# Altium schematic sheet Motor.SchDoc
size A
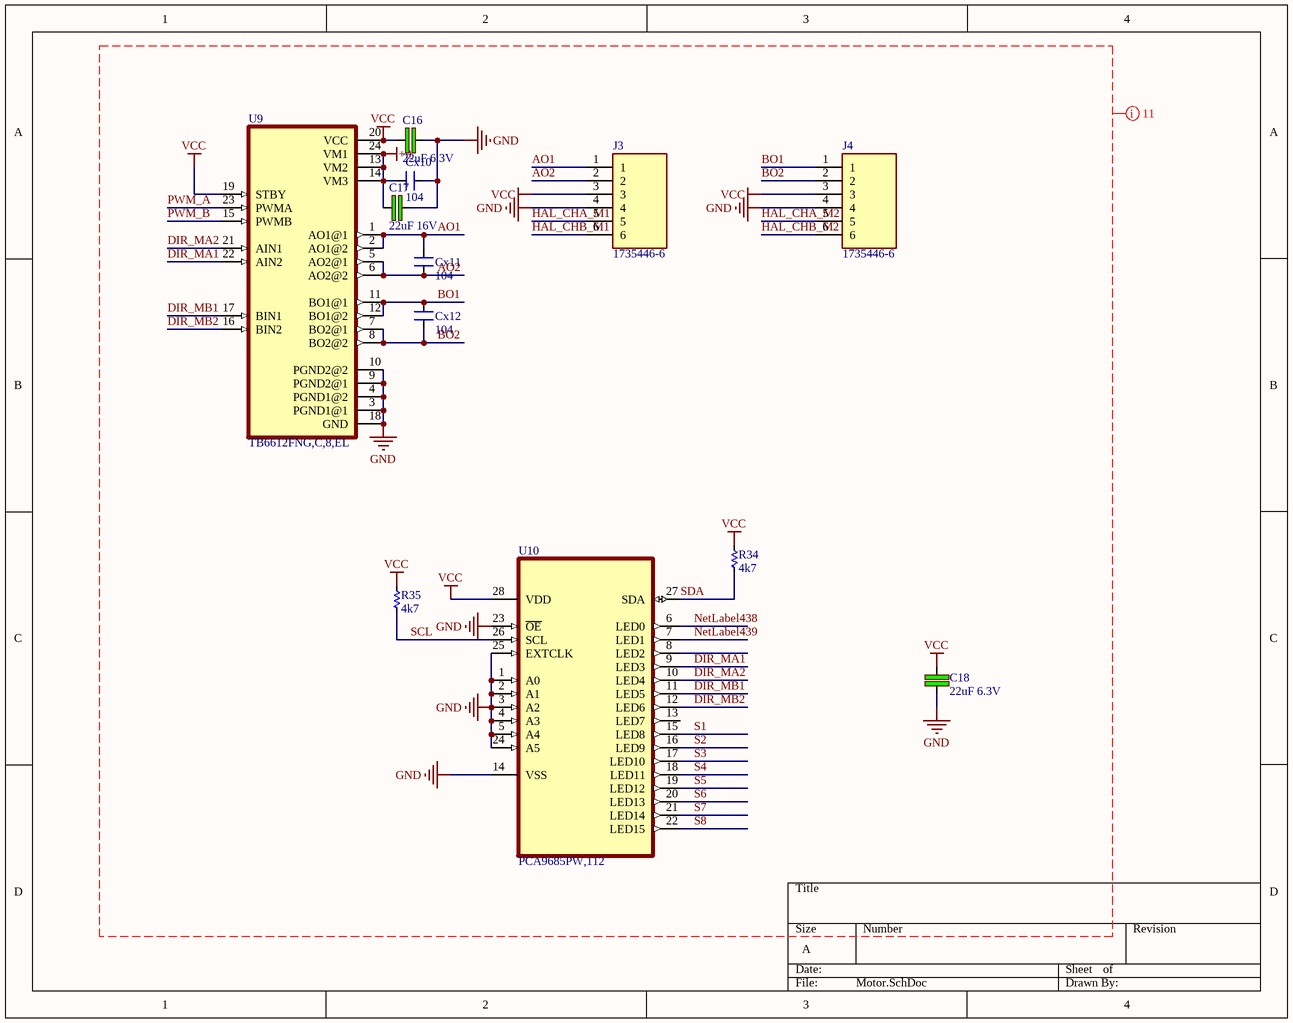
[diagram p0: Motor.SchDoc]

## Parts
C16  22uF 6.3V  [CN-SMD-1206]
C17  22uF 16V  [CN-SMD-1206]
C18  22uF 6.3V  [CN-SMD-1206]
Cx10  104  [CN-SMD-0603]
Cx11  104  [CN-SMD-0603]
Cx12  104  [CN-SMD-0603]
J3  1735446-6  [TE_1735446-6]
J4  1735446-6  [TE_1735446-6]
R34  4k7  [RES-SMD-0603]
R35  4k7  [RES-SMD-0603]
U9  TB6612FNG,C,8,EL  [SOP65P760X160-24N]
U10  PCA9685PW,112  [SOP65P640X110-28N]

## Nets
+9: C17.1 Cx10.2 U9.13(VM2) U9.14(VM3) U9.24(VM1)
GND: C16.1 C17.2 C18.1 Cx10.1 J3.4 J4.4 U9.3(PGND1@1) U9.4(PGND1@2) U9.9(PGND2@1) U9.10(PGND2@2) U9.18(GND) U10.1(A0) U10.2(A1) U10.3(A2) U10.4(A3) U10.5(A4) U10.14(VSS) U10.23(~{OE}) U10.24(A5) U10.25(EXTCLK)
VCC: C16.2 C18.2 J3.3 J4.3 R34.2 R35.2 U9.19(STBY) U9.20(VCC) U10.28(VDD)
AO1: Cx11.1 J3.1 U9.1(AO1@1) U9.2(AO1@2)
AO2: Cx11.2 J3.2 U9.5(AO2@1) U9.6(AO2@2)
BO1: Cx12.1 J4.1 U9.11(BO1@1) U9.12(BO1@2)
BO2: Cx12.2 J4.2 U9.7(BO2@1) U9.8(BO2@2)
DIR_MA1: U9.22(AIN2) U10.9(LED3)
DIR_MA2: U9.21(AIN1) U10.10(LED4)
DIR_MB1: U9.17(BIN1) U10.11(LED5)
DIR_MB2: U9.16(BIN2) U10.12(LED6)
HAL_CHA_M1: J3.5
HAL_CHA_M2: J4.5
HAL_CHB_M1: J3.6
HAL_CHB_M2: J4.6
NetLabel438: U10.6(LED0)
NetLabel439: U10.7(LED1)
PWM_A: U9.23(PWMA)
PWM_B: U9.15(PWMB)
S1: U10.15(LED8)
S2: U10.16(LED9)
S3: U10.17(LED10)
S4: U10.18(LED11)
S5: U10.19(LED12)
S6: U10.20(LED13)
S7: U10.21(LED14)
S8: U10.22(LED15)
SCL: R35.1 U10.26(SCL)
SDA: R34.1 U10.27(SDA)

Not connected (* = marked no-connect by the designer): U10 8(LED2) 13(LED7)

## Layout directives
net class Motor: +9, AO1, AO2, BO1, BO2, DIR_MA1, DIR_MA2, DIR_MB1, DIR_MB2, GND, HAL_CHA_M1, HAL_CHA_M2, HAL_CHB_M1, HAL_CHB_M2, NetLabel438, NetLabel439, PWM_A, PWM_B, S1, S2, S3, S4, S5, S6, S7, S8, SCL, SDA, VCC

## Library data of the parts
C16-C18 = C: Cap SMD 1206 >5V; Value: 103
Cx10-Cx12 = CN: Value: 33pF
J3 J4 = 1735446-6: 2MM PITCH HPI POST HEADER, VERTICAL, 6P; Centerline_Pitch: 2 mm[.079 in]; Number_of_Positions: 6; MF: TE Connectivity; Product_Type: Connector; Availability: Unavailable; EU_RoHS_Compliance: Compliant; SnapEDA_Link: https://www.snapeda.com/parts/1735446-6/TE%20Connectivity%20AMP%20Connectors/view-part/492311/?ref=snap; Price: None; Package: None; MP: 1735446-6; TE_purchase_URL: https://www.te.com/usa-en/product-1735446-6.html?te_bu=Cor&te_type=disp&te_campaign=seda_glo_cor-seda-global-disp-prtnr-fy19-seda-model-bom-cta_sma-317_1&elqCampaignId=32493; Value: *
R34 R35 = Res-SMD: Resistor; Manufacturer: Generic Components; Class: Passive; Published: 08/06/2000; Publisher: Altium Hobart Technology Centre
U9 = TB6612FNG,C,8,EL: Motor Driver Power MOSFET Parallel 24-SSOP; MF: Toshiba; Digi-Key_Part_Number: TB6612FNGC8ELCT-ND; MP: TB6612FNG,C,8,EL; Value: *; SnapEDA_Link: https://www.snapeda.com/parts/TB6612FNG%2CC%2C8%2CEL/Toshiba%20Semiconductor%20and%20Storage/view-part/424445/?ref=snap; Digi-Key_Purchase_URL: https://www.digikey.com/product-detail/en/toshiba-semiconductor-and-storage/TB6612FNG,C,8,EL/TB6612FNGC8ELCT-ND/1730134?utm_source=snapeda&utm_medium=aggregator&utm_campaign=symbol; Package: SSOP-24 Toshiba
U10 = PCA9685PW,112: LED Driver IC 16 Output Linear PWM Dimming 25mA 28-TSSOP; MF: NXP USA; Purchase-URL: https://pricing.snapeda.com/search/part/PCA9685PW,112/?ref=eda; Value: *; Package: TSSOP-28 NXP Semiconductors; Digi-Key_Part_Number: 568-8366-5-ND; SnapEDA_Link: https://www.snapeda.com/parts/PCA9685PW,112/NXP%20USA%20Inc./view-part/550390/?ref=snap; MP: PCA9685PW,112; Check_prices: https://www.snapeda.com/parts/PCA9685PW,112/NXP%20USA%20Inc./view-part/550390/?ref=eda